# Altium project BrakePlaus2019.PrjPCB
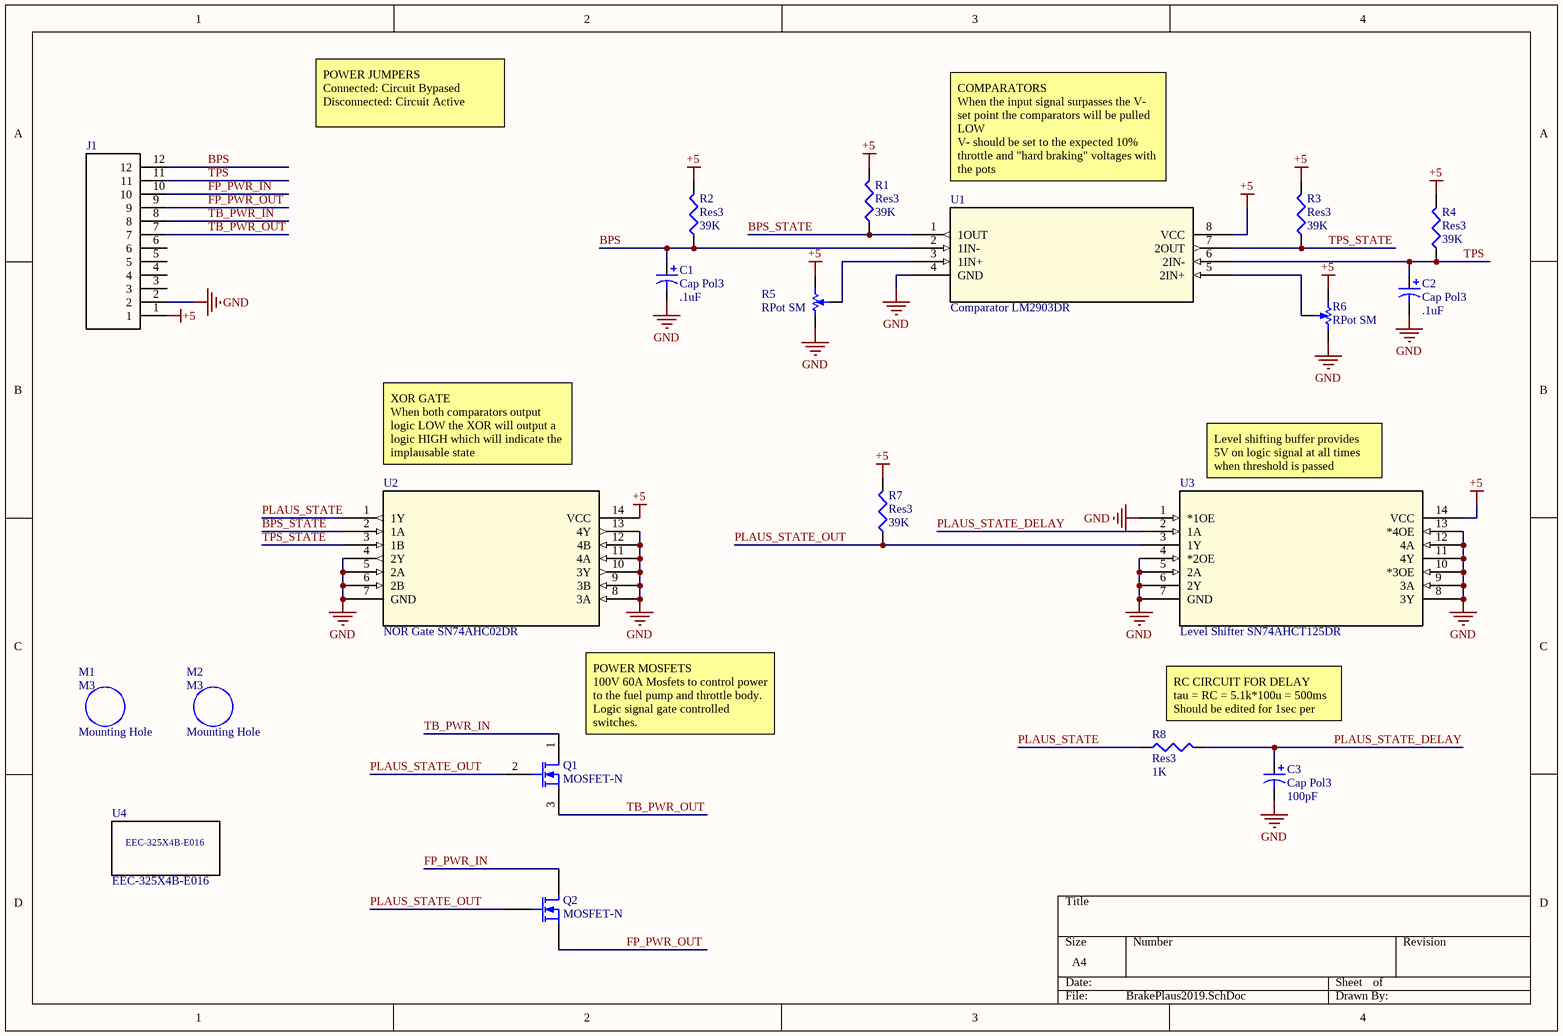
[diagram p0: BrakePlaus2019.SchDoc]
1 sheet, 20 parts. Net scope: global (net labels, ports and power ports of the same name join across sheets).
Board file: BrakePlaus2019.PcbDoc

## Sheet BrakePlaus2019.SchDoc
size A4

### Parts
C1  Cap Pol3  value .1uF  [C0805]
C2  Cap Pol3  value .1uF  [C0805]
C3  Cap Pol3  value 100pF  [C0805]
J1  DTM13-12PA-R008  [*TE_DTM13-12PA-R008]  (value not drawn)
M1  Mounting Hole  [M3 Mounting Hole]
M2  Mounting Hole  [M3 Mounting Hole]
Q1  MOSFET-N  [DPAK]
Q2  MOSFET-N  [DPAK]
R1  Res3  value 39K  [J1-0603]
R2  Res3  value 39K  [J1-0603]
R3  Res3  value 39K  [J1-0603]
R4  Res3  value 39K  [J1-0603]
R5  RPot SM  [POT4MM-2]
R6  RPot SM  [POT4MM-2]
R7  Res3  value 39K  [J1-0603]
R8  Res3  value 1K  [J1-0603]
U1  Comparator LM2903DR  [D8]
U2  NOR Gate SN74AHC02DR  [D14]
U3  Level Shifter SN74AHCT125DR  [D14]
U4  EEC-325X4B-E016  [*TE_EEC-325X4B-E016]

### Nets
+5: J1.1 R1.2 R2.2 R3.2 R4.2 R5.CW(+) R6.CCW(-) R7.2 U1.8(VCC) U2.14(VCC) U3.14(VCC)
GND: C1.2 C2.2 C3.2 J1.2 R5.CCW(-) R6.CW(+) U1.4(GND) U2.4(2Y) U2.5(2A) U2.6(2B) U2.7(GND) U2.8(3A) U2.9(3B) U2.10(3Y) U2.11(4A) U2.12(4B) U2.13(4Y) U3.1(*1OE) U3.4(*2OE) U3.5(2A) U3.6(2Y) U3.7(GND) U3.8(3Y) U3.9(3A) U3.10(*3OE) U3.11(4Y) U3.12(4A) U3.13(*4OE)
BPS: C1.1 J1.12 R2.1 U1.2(1IN-)
BPS_STATE: R1.1 U1.1(1OUT) U2.2(1A)
FP_PWR_IN: J1.10 Q2.1(D)
FP_PWR_OUT: J1.9 Q2.3(S)
PLAUS_STATE: R8.1 U2.1(1Y)
PLAUS_STATE_DELAY: C3.1 R8.2 U3.2(1A)
PLAUS_STATE_OUT: Q1.2(G) Q2.2(G) R7.1 U3.3(1Y)
TB_PWR_IN: J1.8 Q1.1(D)
TB_PWR_OUT: J1.7 Q1.3(S)
TPS: C2.1 J1.11 R4.1 U1.6(2IN-)
TPS_STATE: R3.1 U1.7(2OUT) U2.3(1B)
NetR5_W: R5.W U1.3(1IN+)
NetR6_W: R6.W U1.5(2IN+)

Not connected (* = marked no-connect by the designer): J1 3 4 5 6

### Notes on the sheet
- POWER JUMPERS
  Connected: Circuit Bypased
  Disconnected: Circuit Active
- COMPARATORS
  When the input signal surpasses the V- set point the comparators will be pulled LOW
  V- should be set to the expected 10% throttle and "hard braking" voltages with the pots
- XOR GATE
  When both comparators output logic LOW the XOR will output a logic HIGH which will indicate the implausable state
- (near U3) Level shifting buffer provides 5V on logic signal at all times when threshold is passed
- (near R8) RC CIRCUIT FOR DELAY
  tau = RC = 5.1k*100u = 500ms
  Should be edited for 1sec per rules
- POWER MOSFETS
  100V 60A Mosfets to control power to the fuel pump and throttle body. Logic signal gate controlled switches.
- (in symbol M3 Mounting Hole) M3

### Library data of the parts
C1-C3 = Cap Pol3: Polarized Capacitor (Surface Mount); Published: 8-Jun-2000; LatestRevisionDate: 29-May-2009; LatestRevisionNote: IPC-7351 Footprint Added.; PackageReference: C0805; Publisher: Altium Limited; PackageDescription: Chip Capacitor
J1 = DTM13-12PA-R008: DTM Series, 4.19mm Pitch 12 Way 2 Row Right Angle PCB Header, Solder Termination; MF: TE Connectivity; Digi-Key_Part_Number: 1734-1130-ND; SnapEDA_Link: https://www.snapeda.com/parts/DTM13-12PA-R008/TE%20Connectivity%20Deutsch%20Connectors/view-part/?ref=snap; EU_RoHS_Compliance: Compliant; Package: None; Digi-Key_Purchase_URL: https://www.digikey.ca/product-detail/en/te-connectivity-deutsch-connectors/DTM13-12PA-R008/1734-1130-ND/6566694?utm_source=snapeda&utm_medium=aggregator&utm_campaign=symbol; MP: DTM13-12PA-R008; TE_purchase_URL: https://www.te.com/usa-en/product-DTM13-12PA-R008.html?te_bu=Cor&te_type=disp&te_campaign=seda_glo_cor-seda-global-disp-prtnr-fy19-seda-model-bom-cta_sma-317_1&elqCampaignId=32493; Value: *
M1 M2 = M3 Mounting Hole
Q1 Q2 = MOSFET-N: N-Channel MOSFET; Published: 8-Jun-2000; LatestRevisionDate: 17-Jul-2002; LatestRevisionNote: Re-released for DXP Platform.; PackageVersion: 1995/1996; PackageReference: E3; Publisher: Altium Limited; PackageDescription: TO, Flat Index; 3 In-Line, Axial Leads; Body Dia. 4.6mm; Lead Dia. 0.5 mm (max)
R1-R4 R7 R8 = Res3: Resistor; Published: 8-Jun-2000; LatestRevisionDate: 29-May-2009; LatestRevisionNote: IPC-7351 Footprint Added.; PackageReference: J1-0603; Publisher: Altium Limited; PackageDescription: Chip Resistor
R5 R6 = RPot SM: Square Trimming Potentiometer; Published: 17-Dec-2003; DatasheetVersion: Oct-2003; PackageReference: POT4MM-2; Publisher: Altium Limited; PackageDescription: Square Trimming Potentiometer; ComponentLink1Description: Manufacturer Link; ComponentLink1URL: http://bourns.com/2/search.html
U1 = LM2903DR: Comparator; Manufacturer: Texas Instruments; Built_By: EMA_UL_Team; Vendor: Texas Instruments; Manufacturer_Part_Number: LM2903DR; Copyright: Copyright (C) 2018 Accelerated Designs. All rights reserved; RefDes: RefDes; Type: DEV; Value: Value
U2 = NOR Gate: Quad 2 Input NOR Gate; Manufacturer: Texas Instruments; Built_By: EMA_UL_Team; Vendor: Vendor; Manufacturer_Part_Number: SN74AHC02DR; Copyright: Copyright (C) 2018 Accelerated Designs. All rights reserved; RefDes: RefDes; Type: DEV; Value: Value
U3 = SN74AHCT125DR: Buffer (Level Shifter); Manufacturer: Texas Instruments; Built_By: EMA_UL_Team; Vendor: Vendor; Manufacturer_Part_Number: SN74AHCT125DR; Copyright: Copyright (C) 2018 Accelerated Designs. All rights reserved; RefDes: RefDes; Type: DEV; Value: Value
U4 = EEC-325X4B-E016: Value: *